# EAGLE schematic MotorController (EAGLE 5.10)
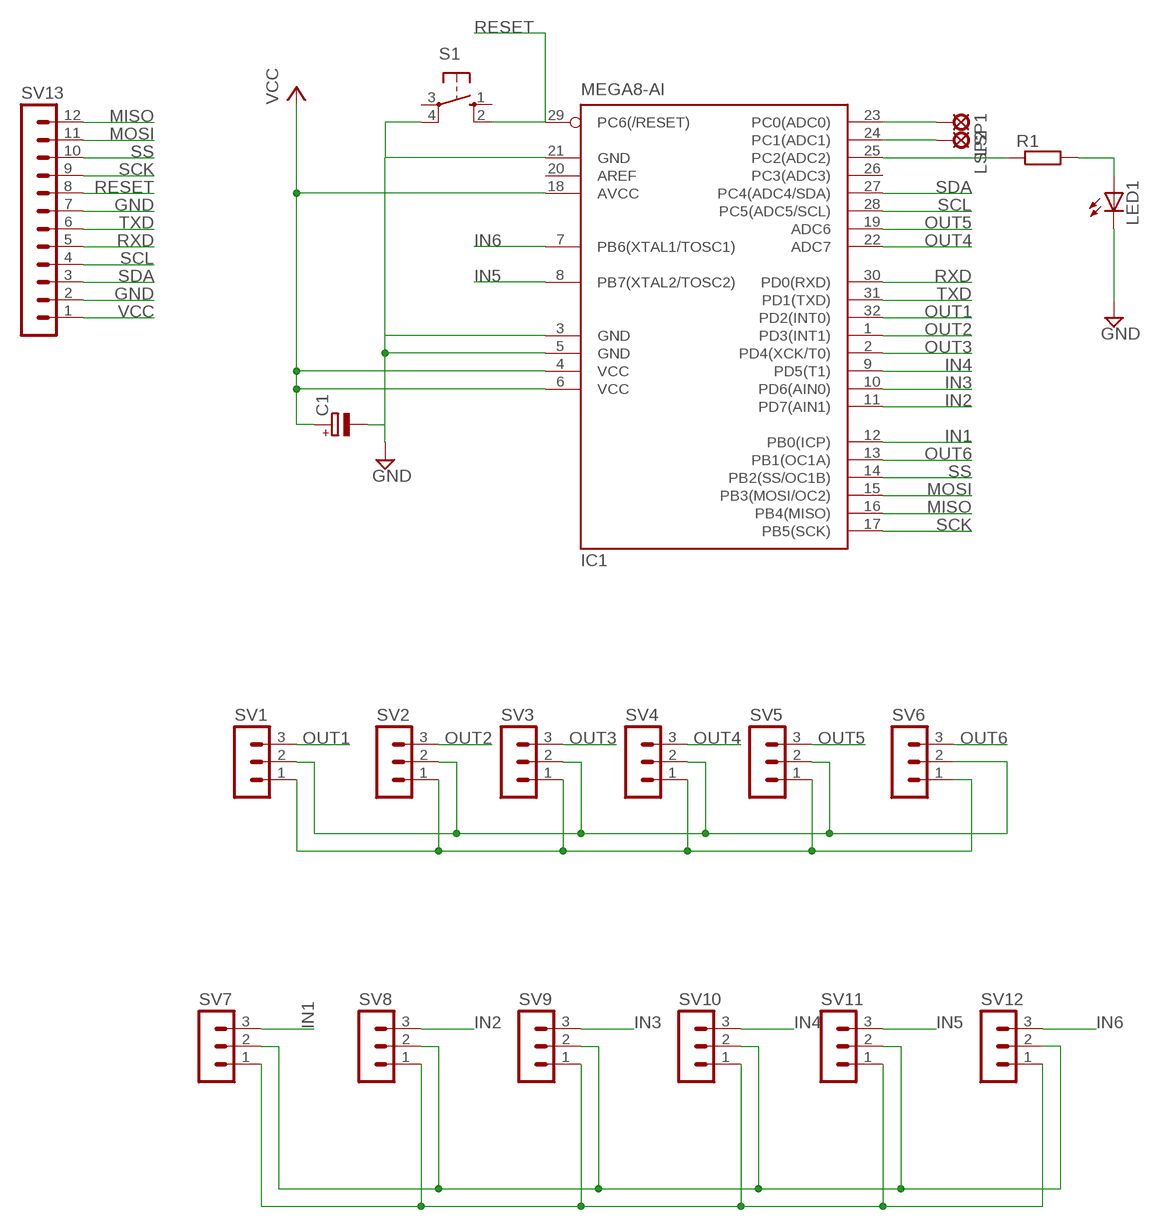
[diagram p0: schematic, sheet 1]

## Parts
C1  CPOL-EUE5-6  [E5-6]
IC1  MEGA8-AI  [TQFP32-08]
LED1  LEDCHIPLED_0805  [CHIPLED_0805]
LSP1  LSP10  [LSP10]
LSP2  LSP10  [LSP10]
R1  R-EU_M0805  [M0805]
S1  10-XX  [B3F-10XX]
SV1  MA03-1  [MA03-1]
SV2  MA03-1  [MA03-1]
SV3  MA03-1  [MA03-1]
SV4  MA03-1  [MA03-1]
SV5  MA03-1  [MA03-1]
SV6  MA03-1  [MA03-1]
SV7  MA03-1  [MA03-1]
SV8  MA03-1  [MA03-1]
SV9  MA03-1  [MA03-1]
SV10  MA03-1  [MA03-1]
SV11  MA03-1  [MA03-1]
SV12  MA03-1  [MA03-1]
SV13  MA12-1W  [MA12-1W]

## Nets
ADC0: IC1.23(PC0(ADC0)) LSP1.MP
ADC1: IC1.24(PC1(ADC1)) LSP2.MP
GND: C1.- IC1.3(GND) IC1.21(GND) LED1.C S1.4(P1) SV1.1 SV2.1 SV3.1 SV4.1 SV5.1 SV6.1 SV7.1 SV8.1 SV9.1 SV10.1 SV11.1 SV12.1 SV13.2 SV13.7
IN1: IC1.12(PB0(ICP)) SV7.3
IN2: IC1.11(PD7(AIN1)) SV8.3
IN3: IC1.10(PD6(AIN0)) SV9.3
IN4: IC1.9(PD5(T1)) SV10.3
IN5: IC1.8(PB7(XTAL2/TOSC2)) SV11.3
IN6: IC1.7(PB6(XTAL1/TOSC1)) SV12.3
MISO: IC1.16(PB4(MISO)) SV13.12
MOSI: IC1.15(PB3(MOSI/OC2)) SV13.11
N$3: IC1.25(PC2(ADC2)) R1.1
N$4: LED1.A R1.2
OUT1: IC1.32(PD2(INT0)) SV1.3
OUT2: IC1.1(PD3(INT1)) SV2.3
OUT3: IC1.2(PD4(XCK/T0)) SV3.3
OUT4: IC1.22(ADC7) SV4.3
OUT5: IC1.19(ADC6) SV5.3
OUT6: IC1.13(PB1(OC1A)) SV6.3
RESET: IC1.29(PC6(/RESET)) S1.2(S1) SV13.8
RXD: IC1.30(PD0(RXD)) SV13.5
SCK: IC1.17(PB5(SCK)) SV13.9
SCL: IC1.28(PC5(ADC5/SCL)) SV13.4
SDA: IC1.27(PC4(ADC4/SDA)) SV13.3
SS: IC1.14(PB2(SS/OC1B)) SV13.10
TXD: IC1.31(PD1(TXD)) SV13.6
VCC: C1.+ IC1.4(VCC) IC1.6(VCC) IC1.18(AVCC) SV1.2 SV2.2 SV3.2 SV4.2 SV5.2 SV6.2 SV7.2 SV8.2 SV9.2 SV10.2 SV11.2 SV12.2 SV13.1
Unconnected: IC1.20(AREF) IC1.26(PC3(ADC3)) S1.1(S) S1.3(P)

## Power pins joined to a net without a drawn wire
GND: IC1.5(GND)

## Library data of the parts
C1 = resistor:CPOL-EU: POLARIZED CAPACITOR, European symbol
IC1 = atmel:MEGA8: MICROCONTROLLER 8 Kbytes FLASH, 1 kbytes SRAM, 512 bytes EEPROM, USART, 6-channel 10 bit ADC, 2-channel 8 bit ADC Pin compatible with Atmega48, ATMega88, ATMega168 Source: avr.lbr
LED1 = led:LED: LED OSRAM: - CHIPLED LG R971, LG N971, LY N971, LG Q971, LY Q971, LO R971, LY R971 LH N974, LH R974 LS Q976, LO Q976, LY Q976 LO Q996 - Hyper CHIPLED LW Q18S LB Q993, LB Q99A, LB R99A - SideLED LS A670, LO A670, LY A670, LG A670, LP A670 LB A673, LV A673, LT A673, LW A673 LH A674 LY A675 LS A676, LA A676, LO A676, LY A676, LW A676 LS A679, LY A679, LG A679 - Hyper Micro SIDELED® LS Y876, LA Y876, LO Y876, LY Y876 LT Y87S - SmartLED LW L88C, LW L88S LB L89C, LB L89S, LG L890 LS L89K, LO L89K, LY L89K LS L896, LA L896, LO L896, LY L896 - TOPLED LS T670, LO T670, LY T670, LG T670, LP T670 LSG T670, LSP T670, LSY T670, LOP T670, LYG T670 LG T671, LOG T671, LSG T671 LB T673, LV T673, LT T673, LW T673 LH T674 LS T676, LA T676, LO T676, LY T676, LB T676, LH T676, LSB T676, LW T676 LB T67C, LV T67C, LT T67C, LS T67K, LO T67K, LY T67K, LW E67C LS E67B, LA E67B, LO E67B, LY E67B, LB E67C, LV E67C, LT E67C LW T67C LS T679, LY T679, LG T679 LS T770, LO T770, LY T770, LG T770, LP T770 LB T773, LV T773, LT T773, LW T773 LH T774 LS E675, LA E675, LY E675, LS T675 LS T776, LA T776, LO T776, LY T776, LB T776 LHGB T686 LT T68C, LB T68C - Hyper Mini TOPLED® LB M676 - Mini TOPLED Santana® LG M470 LS M47K, LO M47K, LY M47K Source: http://www.osram.convergy.de LUXEON: - LUMILED® LXK2-PW12-R00, LXK2-PW12-S00, LXK2-PW14-U00, LXK2-PW14-V00 LXK2-PM12-R00, LXK2-PM12-S00, LXK2-PM14-U00 LXK2-PE12-Q00, LXK2-PE12-R00, LXK2-PE12-S00, LXK2-PE14-T00, LXK2-PE14-U00 LXK2-PB12-K00, LXK2-PB12-L00, LXK2-PB12-M00, LXK2-PB14-N00, LXK2-PB14-P00, LXK2-PB14-Q00 LXK2-PR12-L00, LXK2-PR12-M00, LXK2-PR14-Q00, LXK2-PR14-R00 LXK2-PD12-Q00, LXK2-PD12-R00, LXK2-PD12-S00 LXK2-PH12-R00, LXK2-PH12-S00 LXK2-PL12-P00, LXK2-PL12-Q00, LXK2-PL12-R00 Source: www.luxeon.com KINGBRIGHT: KA-3528ASYC Source: www.kingbright.com
LSP1 LSP2 = solpad:LSP10: SOLDER PAD drill 1.0 mm, distributor Buerklin, 12H555
R1 = resistor:R-EU_: RESISTOR, European symbol
S1 = switch-omron:10-XX: OMRON SWITCH
SV1-SV12 = con-lstb:MA03-1: PIN HEADER
SV13 = con-lstb:MA12-1W: PIN HEADER